# EAGLE design AmpSwitchAutomatic_main (EAGLE 6.0)
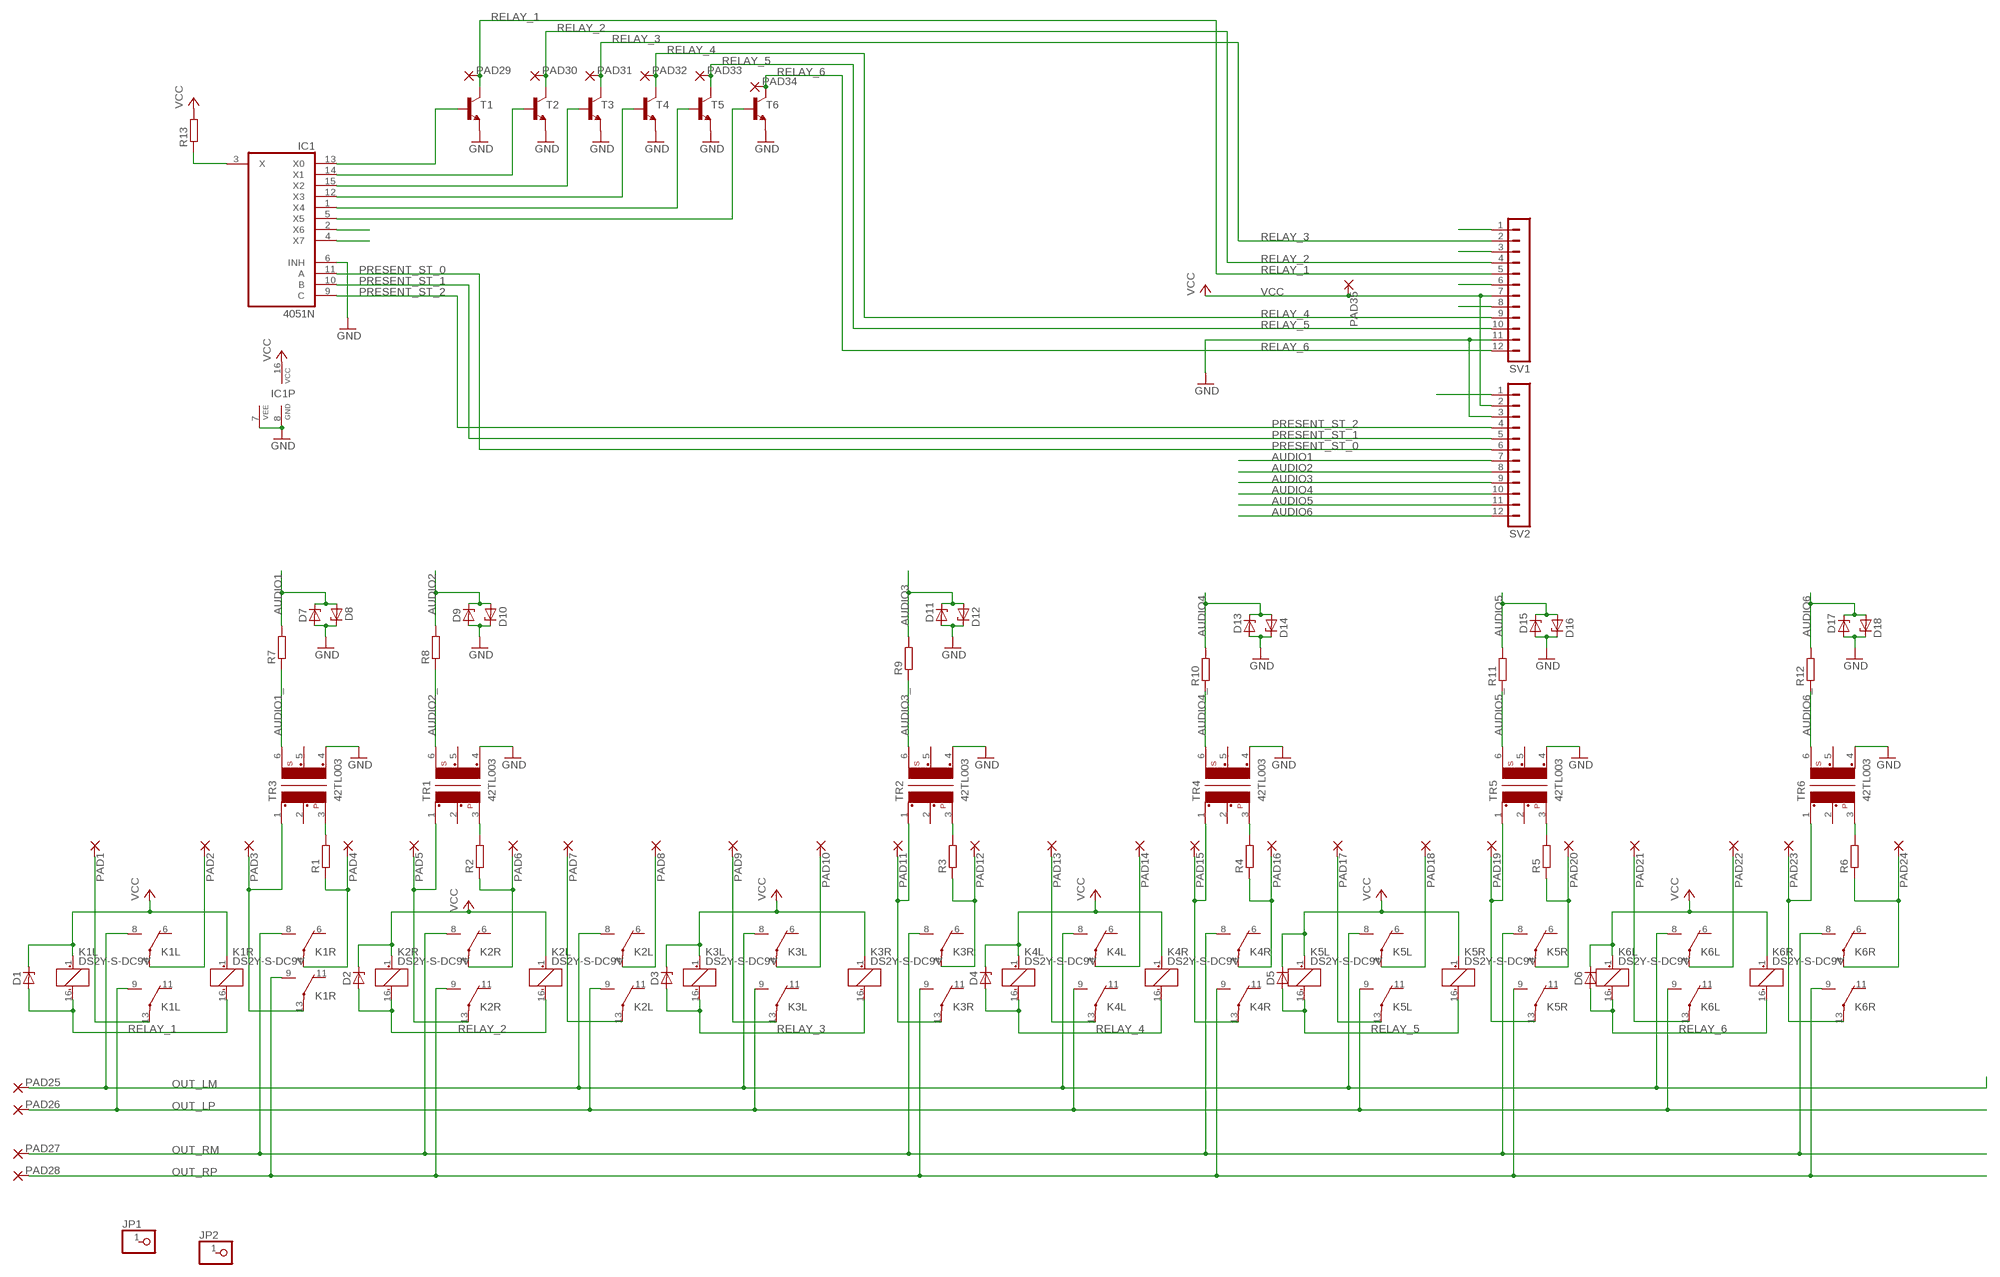
[diagram p0: schematic, sheet 1]

## Parts
D1  ZENER-DIODEZD-5  [ZDIO-5]
D2  ZENER-DIODEZD-7.5  [ZDIO-7.5]
D3  ZENER-DIODEZD-12.5  [ZDIO12.5]
D4  ZENER-DIODEZD-5  [ZDIO-5]
D5  ZENER-DIODEZD-5  [ZDIO-5]
D6  ZENER-DIODEZD-12.5  [ZDIO12.5]
D7  ZENER-DIODEZD-7.5  [ZDIO-7.5]
D8  ZENER-DIODEZD-7.5  [ZDIO-7.5]
D9  ZENER-DIODEZD-7.5  [ZDIO-7.5]
D10  ZENER-DIODEZD-7.5  [ZDIO-7.5]
D11  ZENER-DIODEZD-7.5  [ZDIO-7.5]
D12  ZENER-DIODEZD-7.5  [ZDIO-7.5]
D13  ZENER-DIODEZD-7.5  [ZDIO-7.5]
D14  ZENER-DIODEZD-7.5  [ZDIO-7.5]
D15  ZENER-DIODEZD-7.5  [ZDIO-7.5]
D16  ZENER-DIODEZD-7.5  [ZDIO-7.5]
D17  ZENER-DIODEZD-7.5  [ZDIO-7.5]
D18  ZENER-DIODEZD-7.5  [ZDIO-7.5]
IC1  4051N  [DIL16]
JP1  PINHD-1X1  [1X01]
JP2  PINHD-1X1  [1X01]
K1L  DS2Y-S-DC9V  [DS2Y]
K1R  DS2Y-S-DC9V  [DS2Y]
K2L  DS2Y-S-DC9V  [DS2Y]
K2R  DS2Y-S-DC9V  [DS2Y]
K3L  DS2Y-S-DC9V  [DS2Y]
K3R  DS2Y-S-DC9V  [DS2Y]
K4L  DS2Y-S-DC9V  [DS2Y]
K4R  DS2Y-S-DC9V  [DS2Y]
K5L  DS2Y-S-DC9V  [DS2Y]
K5R  DS2Y-S-DC9V  [DS2Y]
K6L  DS2Y-S-DC9V  [DS2Y]
K6R  DS2Y-S-DC9V  [DS2Y]
PAD1  WIREPAD2,15/1,0  [2,15/1,0]
PAD2  WIREPAD2,15/1,0  [2,15/1,0]
PAD3  WIREPAD2,15/1,0  [2,15/1,0]
PAD4  WIREPAD2,15/1,0  [2,15/1,0]
PAD5  WIREPAD2,15/1,0  [2,15/1,0]
PAD6  WIREPAD2,15/1,0  [2,15/1,0]
PAD7  WIREPAD2,15/1,0  [2,15/1,0]
PAD8  WIREPAD2,15/1,0  [2,15/1,0]
PAD9  WIREPAD2,15/1,0  [2,15/1,0]
PAD10  WIREPAD2,15/1,0  [2,15/1,0]
PAD11  WIREPAD2,15/1,0  [2,15/1,0]
PAD12  WIREPAD2,15/1,0  [2,15/1,0]
PAD13  WIREPAD2,15/1,0  [2,15/1,0]
PAD14  WIREPAD2,15/1,0  [2,15/1,0]
PAD15  WIREPAD2,15/1,0  [2,15/1,0]
PAD16  WIREPAD2,15/1,0  [2,15/1,0]
PAD17  WIREPAD2,15/1,0  [2,15/1,0]
PAD18  WIREPAD2,15/1,0  [2,15/1,0]
PAD19  WIREPAD2,15/1,0  [2,15/1,0]
PAD20  WIREPAD2,15/1,0  [2,15/1,0]
PAD21  WIREPAD2,15/1,0  [2,15/1,0]
PAD22  WIREPAD2,15/1,0  [2,15/1,0]
PAD23  WIREPAD2,15/1,0  [2,15/1,0]
PAD24  WIREPAD2,15/1,0  [2,15/1,0]
PAD25  WIREPAD2,15/1,0  [2,15/1,0]
PAD26  WIREPAD2,15/1,0  [2,15/1,0]
PAD27  WIREPAD2,15/1,0  [2,15/1,0]
PAD28  WIREPAD2,15/1,0  [2,15/1,0]
PAD29  WIREPAD2,15/1,0  [2,15/1,0]
PAD30  WIREPAD2,15/1,0  [2,15/1,0]
PAD31  WIREPAD2,15/1,0  [2,15/1,0]
PAD32  WIREPAD2,15/1,0  [2,15/1,0]
PAD33  WIREPAD2,15/1,0  [2,15/1,0]
PAD34  WIREPAD2,15/1,0  [2,15/1,0]
PAD35  WIREPAD2,15/1,0  [2,15/1,0]
R1  R-EU_0207/15  [0207/15]
R2  R-EU_0207/15  [0207/15]
R3  R-EU_0207/15  [0207/15]
R4  R-EU_0207/15  [0207/15]
R5  R-EU_0207/15  [0207/15]
R6  R-EU_0207/15  [0207/15]
R7  R-EU_0207/12  [0207/12]
R8  R-EU_0207/10  [0207/10]
R9  R-EU_0207/7  [0207/7]
R10  R-EU_0207/5V  [0207/5V]
R11  R-EU_0207/2V  [0207/2V]
R12  R-EU_0207/5V  [0207/5V]
R13  R-EU_0207/7  [0207/7]
SV1  MA12-1  [MA12-1]
SV2  MA12-1  [MA12-1]
T1  2N4124-NPN-TO92-CBE  [TO92-CBE]
T2  2N4124-NPN-TO92-CBE  [TO92-CBE]
T3  2N4124-NPN-TO92-CBE  [TO92-CBE]
T4  2N4124-NPN-TO92-CBE  [TO92-CBE]
T5  2N4124-NPN-TO92-CBE  [TO92-CBE]
T6  2N4124-NPN-TO92-CBE  [TO92-CBE]
TR1  42TL003  [42TL]
TR2  42TL003  [42TL]
TR3  42TL003  [42TL]
TR4  42TL003  [42TL]
TR5  42TL003  [42TL]
TR6  42TL003  [42TL]

## Nets
AUDIO1: D7.C D8.A R7.2 SV2.7
AUDIO1_: R7.1 TR3.6
AUDIO2: D9.C D10.A R8.2 SV2.8
AUDIO2_: R8.1 TR1.6
AUDIO3: D11.C D12.A R9.2 SV2.9
AUDIO3_: R9.1 TR2.6
AUDIO4: D13.C D14.A R10.2 SV2.10
AUDIO4_: R10.1 TR4.6
AUDIO5: D15.C D16.A R11.2 SV2.11
AUDIO5_: R11.1 TR5.6
AUDIO6: D17.C D18.A R12.2 SV2.12
AUDIO6_: R12.1 TR6.6
GND: D7.A D8.C D9.A D10.C D11.A D12.C D13.A D14.C D15.A D16.C D17.A D18.C IC1.6(INH) IC1.7(VEE) IC1.8(GND) SV1.11 SV2.3 T1.E T2.E T3.E T4.E T5.E T6.E TR1.4 TR2.4 TR3.4 TR4.4 TR5.4 TR6.4
N$1: K3R.4(2:P) PAD12.1(P) R3.1
N$3: K4L.13(3:P) PAD13.1(P)
N$4: K1L.13(3:P) PAD1.1(P)
N$11: K2L.13(3:P) PAD7.1(P)
N$12: K1L.4(2:P) PAD2.1(P)
N$13: K3L.13(3:P) PAD9.1(P)
N$14: K1R.13(3:P) PAD3.1(P) TR3.1
N$19: K1R.4(2:P) PAD4.1(P) R1.1
N$20: K3L.4(2:P) PAD10.1(P)
N$21: K4L.4(2:P) PAD14.1(P)
N$22: K2R.13(3:P) PAD5.1(P) TR1.1
N$23: R1.2 TR3.3
N$24: R2.2 TR1.3
N$25: R3.2 TR2.3
N$26: K3R.13(3:P) PAD11.1(P) TR2.1
N$27: K2R.4(2:P) PAD6.1(P) R2.1
N$28: R4.2 TR4.3
N$29: K4R.13(3:P) PAD15.1(P) TR4.1
N$30: K4R.4(2:P) PAD16.1(P) R4.1
N$31: R5.2 TR5.3
N$32: K2L.4(2:P) PAD8.1(P)
N$33: R6.2 TR6.3
N$34: IC1.3(X) R13.1
N$35: IC1.13(X0) T1.B
N$36: IC1.14(X1) T2.B
N$37: IC1.2(X6)
N$38: K5L.13(3:P) PAD17.1(P)
N$39: K5L.4(2:P) PAD18.1(P)
N$40: K5R.13(3:P) PAD19.1(P) TR5.1
N$41: K5R.4(2:P) PAD20.1(P) R5.1
N$42: K6L.13(3:P) PAD21.1(P)
N$43: K6L.4(2:P) PAD22.1(P)
N$44: K6R.13(3:P) PAD23.1(P) TR6.1
N$45: K6R.4(2:P) PAD24.1(P) R6.1
N$46: IC1.15(X2) T3.B
N$47: IC1.12(X3) T4.B
N$48: IC1.1(X4) T5.B
N$49: IC1.5(X5) T6.B
N$50: IC1.4(X7)
N$53: SV2.1
N$54: SV1.6
N$55: SV1.8
N$56: SV1.1
N$57: SV1.3
OUT_LM: K1L.8(2:S) K2L.8(2:S) K3L.8(2:S) K4L.8(2:S) K5L.8(2:S) K6L.8(2:S) PAD25.1(P)
OUT_LP: K1L.9(3:S) K2L.9(3:S) K3L.9(3:S) K4L.9(3:S) K5L.9(3:S) K6L.9(3:S) PAD26.1(P)
OUT_RM: K1R.8(2:S) K2R.8(2:S) K3R.8(2:S) K4R.8(2:S) K5R.8(2:S) K6R.8(2:S) PAD27.1(P)
OUT_RP: K1R.9(3:S) K2R.9(3:S) K3R.9(3:S) K4R.9(3:S) K5R.9(3:S) K6R.9(3:S) PAD28.1(P)
PRESENT_ST_0: IC1.11(A) SV2.6
PRESENT_ST_1: IC1.10(B) SV2.5
PRESENT_ST_2: IC1.9(C) SV2.4
RELAY_1: D1.A K1L.16(1:-) K1R.16(1:-) PAD29.1(P) SV1.5 T1.C
RELAY_2: D2.A K2L.16(1:-) K2R.16(1:-) PAD30.1(P) SV1.4 T2.C
RELAY_3: D3.A K3L.16(1:-) K3R.16(1:-) PAD31.1(P) SV1.2 T3.C
RELAY_4: D4.A K4L.16(1:-) K4R.16(1:-) PAD32.1(P) SV1.9 T4.C
RELAY_5: D5.A K5L.16(1:-) K5R.16(1:-) PAD33.1(P) SV1.10 T5.C
RELAY_6: D6.A K6L.16(1:-) K6R.16(1:-) PAD34.1(P) SV1.12 T6.C
VCC: D1.C D2.C D3.C D4.C D5.C D6.C IC1.16(VCC) K1L.1(1:+) K1R.1(1:+) K2L.1(1:+) K2R.1(1:+) K3L.1(1:+) K3R.1(1:+) K4L.1(1:+) K4R.1(1:+) K5L.1(1:+) K5R.1(1:+) K6L.1(1:+) K6R.1(1:+) PAD35.1(P) R13.2 SV1.7 SV2.2
Unconnected: JP1.1 JP2.1 K1L.6(2:O) K1L.11(3:O) K1R.6(2:O) K1R.11(3:O) K2L.6(2:O) K2L.11(3:O) K2R.6(2:O) K2R.11(3:O) K3L.6(2:O) K3L.11(3:O) K3R.6(2:O) K3R.11(3:O) K4L.6(2:O) K4L.11(3:O) K4R.6(2:O) K4R.11(3:O) K5L.6(2:O) K5L.11(3:O) K5R.6(2:O) K5R.11(3:O) K6L.6(2:O) K6L.11(3:O) K6R.6(2:O) K6R.11(3:O) TR1.2 TR1.5 TR2.2 TR2.5 TR3.2 TR3.5 TR4.2 TR4.5 TR5.2 TR5.5 TR6.2 TR6.5

## Library data of the parts
D1-D18 = diode:ZENER-DIODE: Z-Diode
IC1 = 40xx:4051: 8-channel ANALOG MULTIPLEXER
JP1 JP2 = pinhead:PINHD-1X1: PIN HEADER
K1L K1R K2L K2R K3L K3R K4L K4R K5L K5R K6L K6R = relay:DS2Y-S-DC*: MINIATURE RELAY NAiS Source: http://www.mew-europe.com/.. en_ds_61005_0023.pdf; MPN: DS2Y-S-DC9V; OC_FARNELL: unknown; OC_NEWARK: 13P3272
PAD1-PAD35 = wirepad:WIREPAD: Wire PAD connect wire on PCB
R1-R6 = resistor:R-EU_: RESISTOR, European symbol
R7-R13 = rcl:R-EU_: RESISTOR, European symbol
SV1 SV2 = con-lstb:MA12-1: PIN HEADER; OC_FARNELL: unknown; OC_NEWARK: unknown
T1-T6 = transistor:*-NPN-: NPN Transistror BF959 corrected 2008.03.06
TR1-TR6 = trafo-xicon:42T?*: Xicon Micro-Mini EI-12 Audio Transformers 42TL/42TC/42TM Series Source: http://www.mouser.com//catalog/specsheets/164201.pdf http://www.mouser.com/catalog/specsheets/114225.pdf http://www.mouser.com/catalog/specsheets/164267.pdf; OC_FARNELL: unknown; OC_NEWARK: unknown

## Board
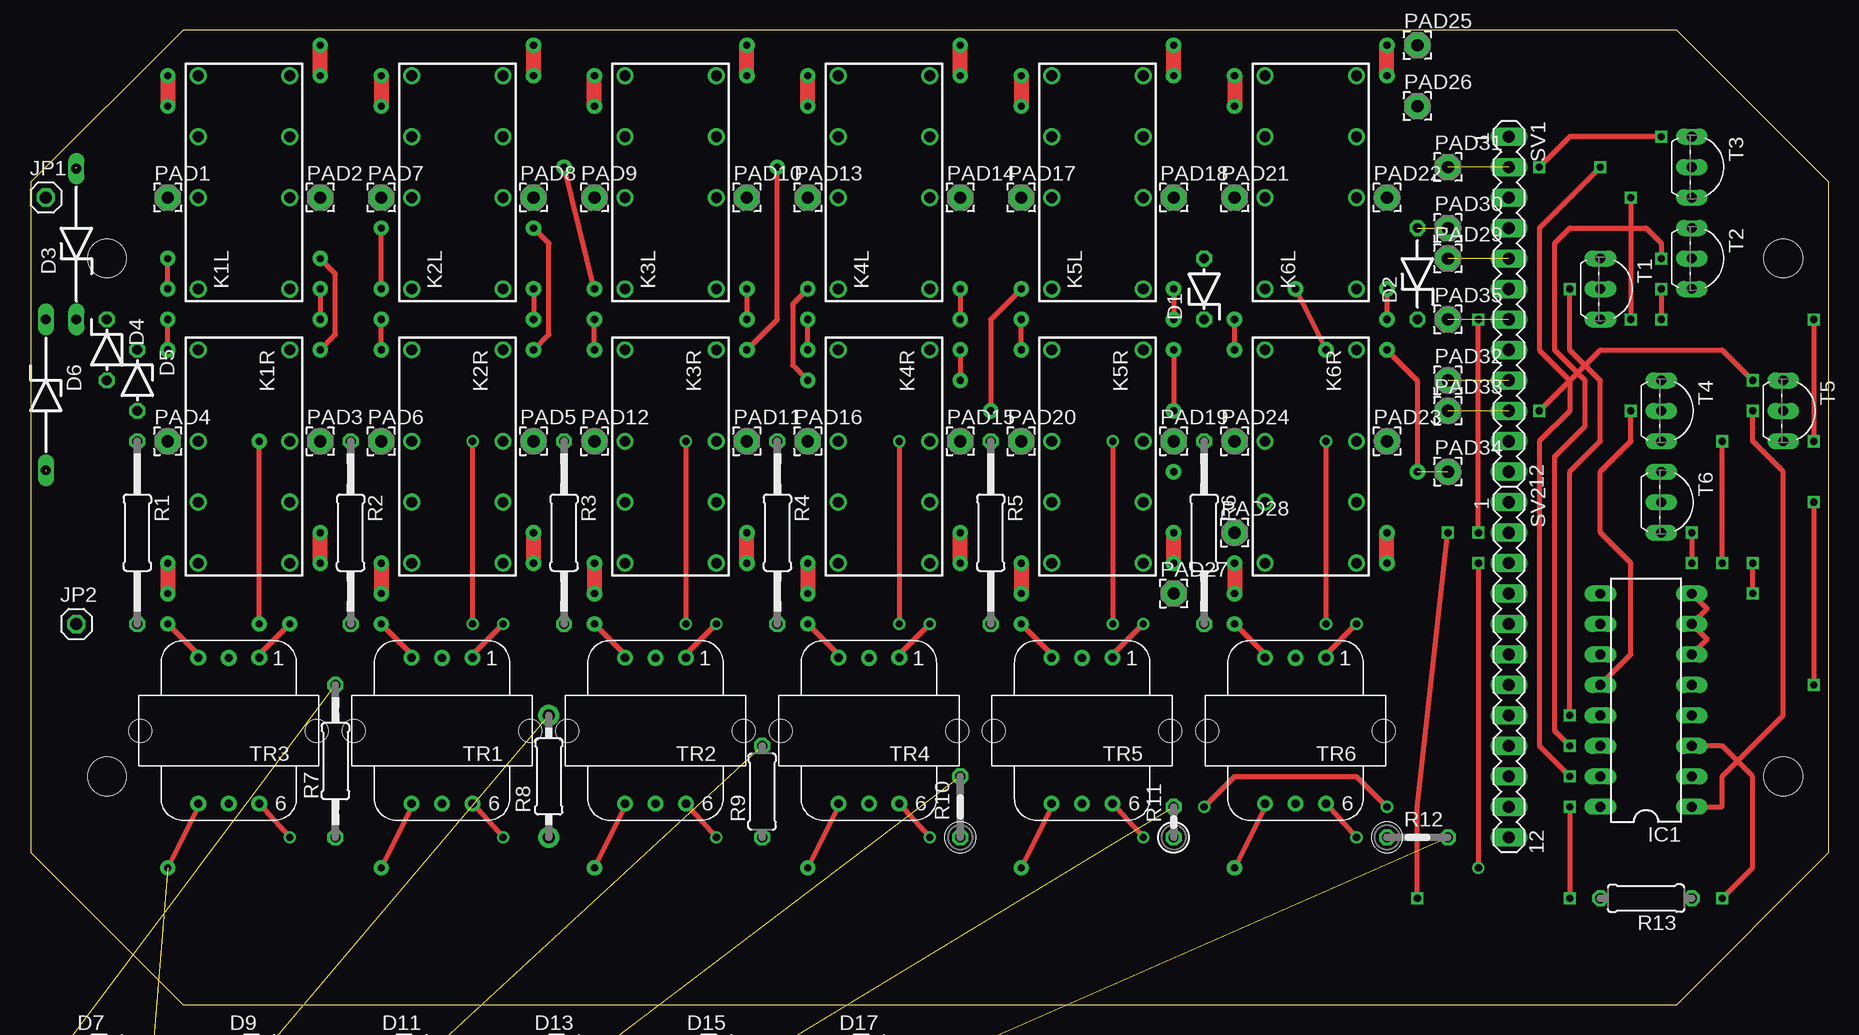
[diagram p1: board, top side]
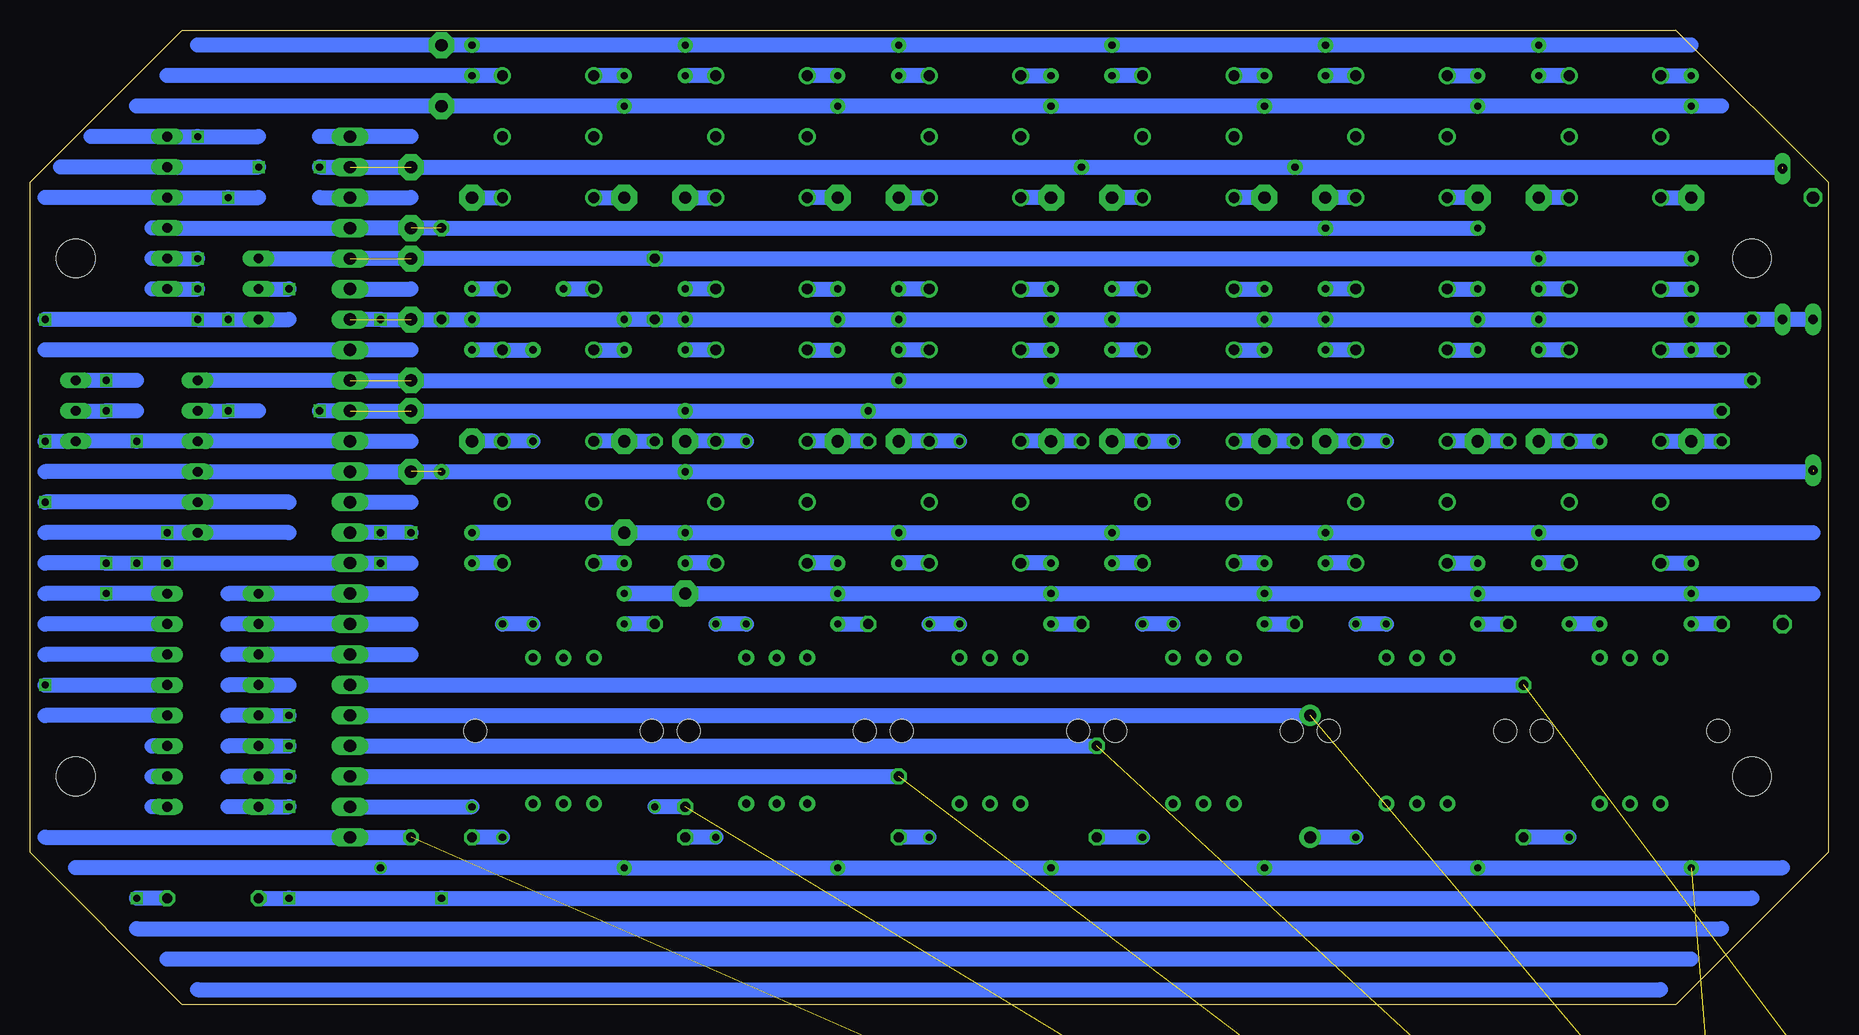
[diagram p2: board, bottom side, seen from below]

Size 149.86 x 81.28 mm. Coordinates in mm from the lower left corner, seen from the top.
Outline: 12.7,0 137.16,0 149.86,12.7 149.86,68.58 137.16,81.28 12.7,81.28 0,68.58 0,12.7 12.7,0
Copper layers (1*16): Top 0.035mm / dielectric 1.5mm / Bottom 0.035mm
Design rules: minimum track width 10mil, minimum drill 24mil, track to track 8mil, track to pad 8mil, pad to pad 8mil, via to via 8mil, smd to smd 8mil, copper to edge 40mil, drill to drill 8mil, minimum pad ring 10mil, minimum via ring 8mil, stop-mask expansion 4mil, vias tented up to drill 0mil, thermal gap 10mil
Holes 3.2 mm at 6.35,19.05 6.35,62.23 146.05,19.05 146.05,62.23
tKeepout: area 139.7,58.4 to 149.9,66; area 139.7,15.2 to 149.9,22.9; area 0,58.4 to 10.2,66; area 0,15.2 to 10.2,22.9

### Footprints (pad centres in the part's own frame; a part is rotated, then mirrored left to right if it is on the bottom)
ZDIO-5 = drill 0.813 octagon: A 2.54,0; C -2.54,0
ZDIO-7.5 = drill 0.813 octagon: A 3.81,0; C -3.81,0
ZDIO12.5 = drill 0.813 long: A 6.223,0; C -6.35,0
DIL16 = drill 0.813 long: 1 -8.89,-3.81; 2 -6.35,-3.81; 3 -3.81,-3.81; 4 -1.27,-3.81; 5 1.27,-3.81; 6 3.81,-3.81; 7 6.35,-3.81; 8 8.89,-3.81; 9 8.89,3.81; 10 6.35,3.81; 11 3.81,3.81; 12 1.27,3.81; 13 -1.27,3.81; 14 -3.81,3.81; 15 -6.35,3.81; 16 -8.89,3.81
1X01 = drill 1.016 octagon: 1 0,0
DS2Y = drill 0.9: 1 -8.89,-3.81; 4 -1.27,-3.81; 6 3.81,-3.81; 8 8.89,-3.81; 9 8.89,3.81; 11 3.81,3.81; 13 -1.27,3.81; 16 -8.89,3.81
2,15/1,0 = drill 1.016 pad 2.159 octagon: 1 0,0
0207/15 = drill 0.813 octagon: 1 -7.62,0; 2 7.62,0
0207/12 = drill 0.813 octagon: 1 -6.35,0; 2 6.35,0
0207/10 = drill 1.016 pad 1.778: 1 -5.08,0; 2 5.08,0
0207/7 = drill 0.813 octagon: 1 -3.81,0; 2 3.81,0
0207/5V = drill 0.813 octagon: 1 -2.54,0; 2 2.54,0
0207/2V = drill 0.813 octagon: 1 -1.27,0; 2 1.27,0
MA12-1 = drill 1.016 long: 1 -13.97,0; 2 -11.43,0; 3 -8.89,0; 4 -6.35,0; 5 -3.81,0; 6 -1.27,0; 7 1.27,0; 8 3.81,0; 9 6.35,0; 10 8.89,0; 11 11.43,0; 12 13.97,0
TO92-CBE = drill 0.813 long: B 0,0; C -2.54,0; E 2.54,0
42TL = drill 0.7 pad 1.3: 1 -2.54,-6.096; 2 0,-6.068; 3 2.54,-6.096; 4 2.54,6.096; 5 0,6.096; 6 -2.54,6.096 | hole 1.9: -7.353,0; 7.353,0

### Placement (x,y rotation side)
D1  97.79,59.69 90 top
D2  115.57,60.96 90 top
D3  3.81,63.5 90 top
D4  6.35,54.61 270 top
D5  8.89,52.07 270 top
D6  1.27,50.8 270 top
D7  6.35,-3.81 0 top  (outside the outline)
D8  6.35,-8.89 180 top  (outside the outline)
D9  19.05,-3.81 0 top  (outside the outline)
D10  19.05,-8.89 180 top  (outside the outline)
D11  31.75,-3.81 0 top  (outside the outline)
D12  31.75,-8.89 180 top  (outside the outline)
D13  44.45,-3.81 0 top  (outside the outline)
D14  44.45,-8.89 180 top  (outside the outline)
D15  57.15,-3.81 0 top  (outside the outline)
D16  57.15,-8.89 180 top  (outside the outline)
D17  69.85,-3.81 0 top  (outside the outline)
D18  69.85,-8.89 180 top  (outside the outline)
IC1  134.62,25.4 90 top
JP1  1.27,67.31 0 top
JP2  3.81,31.75 0 top
K1L  17.78,68.58 90 top
K1R  17.78,45.72 270 top
K2L  35.56,68.58 90 top
K2R  35.56,45.72 270 top
K3L  53.34,68.58 90 top
K3R  53.34,45.72 270 top
K4L  71.12,68.58 90 top
K4R  71.12,45.72 270 top
K5L  88.9,68.58 90 top
K5R  88.9,45.72 270 top
K6L  106.68,68.58 90 top
K6R  106.68,45.72 270 top
PAD1  11.43,67.31 0 top
PAD2  24.13,67.31 0 top
PAD3  24.13,46.99 0 top
PAD4  11.43,46.99 0 top
PAD5  41.91,46.99 0 top
PAD6  29.21,46.99 0 top
PAD7  29.21,67.31 0 top
PAD8  41.91,67.31 0 top
PAD9  46.99,67.31 0 top
PAD10  59.69,67.31 0 top
PAD11  59.69,46.99 0 top
PAD12  46.99,46.99 0 top
PAD13  64.77,67.31 0 top
PAD14  77.47,67.31 0 top
PAD15  77.47,46.99 0 top
PAD16  64.77,46.99 0 top
PAD17  82.55,67.31 0 top
PAD18  95.25,67.31 0 top
PAD19  95.25,46.99 0 top
PAD20  82.55,46.99 0 top
PAD21  100.33,67.31 0 top
PAD22  113.03,67.31 0 top
PAD23  113.03,46.99 0 top
PAD24  100.33,46.99 0 top
PAD25  115.57,80.01 0 top
PAD26  115.57,74.93 0 top
PAD27  95.25,34.29 0 top
PAD28  100.33,39.37 0 top
PAD29  118.11,62.23 0 top
PAD30  118.11,64.77 0 top
PAD31  118.11,69.85 0 top
PAD32  118.11,52.07 0 top
PAD33  118.11,49.53 0 top
PAD34  118.11,44.45 0 top
PAD35  118.11,57.15 0 top
R1  8.89,39.37 270 top
R2  26.67,39.37 270 top
R3  44.45,39.37 270 top
R4  62.23,39.37 270 top
R5  80.01,39.37 270 top
R6  97.79,39.37 270 top
R7  25.4,20.32 90 top
R8  43.18,19.05 90 top
R9  60.96,17.78 90 top
R10  77.47,16.51 90 top
R11  95.25,15.24 90 top
R12  115.57,13.97 0 top
R13  134.62,8.89 180 top
SV1  123.19,58.42 270 top
SV2  123.19,27.94 270 top
T1  130.81,59.69 270 top
T2  138.43,62.23 270 top
T3  138.43,69.85 270 top
T4  135.89,49.53 270 top
T5  146.05,49.53 270 top
T6  135.89,41.91 270 top
TR1  34.29,22.86 180 top
TR2  52.07,22.86 180 top
TR3  16.51,22.86 180 top
TR4  69.85,22.86 180 top
TR5  87.63,22.86 180 top
TR6  105.41,22.86 180 top

### Tracks (layer width: path | path; a pad name or v marks a point on that pad's centre or on a via)
AUDIO1  (2 unrouted)
  Bottom 1.27: SV2.7 R7.2
AUDIO1_  (via drill 0.6)
  Top 0.406: TR3.6 v21.59,13.97
  Bottom 1.27: v21.59,13.97 R7.1
AUDIO2  (2 unrouted)
  Bottom 1.27: SV2.8 R8.2
AUDIO2_  (via drill 0.6)
  Top 0.406: TR1.6 v39.37,13.97
  Bottom 1.27: v39.37,13.97 R8.1
AUDIO3  (2 unrouted)
  Bottom 1.27: SV2.9 R9.2
AUDIO3_  (via drill 0.6)
  Top 0.406: TR2.6 v57.15,13.97
  Bottom 1.27: v57.15,13.97 R9.1
AUDIO4  (2 unrouted)
  Bottom 1.27: SV2.10 R10.2
AUDIO4_  (via drill 0.6)
  Top 0.406: TR4.6 v74.93,13.97
  Bottom 1.27: v74.93,13.97 R10.1
AUDIO5  (via drill 0.6)  (2 unrouted)
  Top 0.406: v97.79,16.51 100.33,19.05 110.49,19.05 v113.03,16.51
  Bottom 1.27: R11.2 v97.79,16.51 | SV2.11 v113.03,16.51
AUDIO5_  (via drill 0.6)
  Top 0.406: TR5.6 v92.71,13.97
  Bottom 1.27: v92.71,13.97 R11.1
AUDIO6  (2 unrouted)
  Bottom 1.27: R12.2 SV2.12 148.59,13.97
AUDIO6_  (via drill 0.6)
  Top 0.406: TR6.6 v110.49,13.97
  Bottom 1.27: v110.49,13.97 R12.1
GND  (via drill 0.6, 0.6 pad 1.27)  (12 unrouted)
  Top 0.406: v11.43,11.43 13.97,16.51 TR3.4 | v29.21,11.43 31.75,16.51 TR1.4 | v46.99,11.43 49.53,16.51 TR2.4 | v64.77,11.43 67.31,16.51 TR4.4 | v82.55,11.43 85.09,16.51 TR5.4 | v100.33,11.43 102.87,16.51 TR6.4 | v120.65,36.83 v120.65,11.43 | v135.89,59.69 v135.89,57.15 | v133.35,67.31 v133.35,57.15 | v148.59,57.15 v148.59,46.99 | v138.43,39.37 v138.43,36.83 | v143.51,34.29 v143.51,36.83 | v140.97,36.83 v140.97,46.99 | IC1.8 139.7,33.02 IC1.7 139.7,30.48 IC1.6
  Bottom 1.27: 3.81,11.43 v11.43,11.43 v29.21,11.43 v46.99,11.43 v64.77,11.43 v82.55,11.43 v100.33,11.43 v120.65,11.43 146.05,11.43 | v138.43,39.37 T6.E | v135.89,59.69 T2.E 139.7,59.69 | v148.59,57.15 v135.89,57.15 v133.35,57.15 T1.E 128.27,57.15 | v148.59,46.99 T5.E v140.97,46.99 T4.E SV1.11 118.11,46.99 | 148.59,36.83 v143.51,36.83 v140.97,36.83 v138.43,36.83 SV2.3 v120.65,36.83 118.11,36.83 | IC1.8 v143.51,34.29 148.59,34.29 | IC1.7 148.59,31.75 | IC1.6 148.59,29.21 | 148.59,67.31 T3.E v133.35,67.31 130.81,67.31
N$1
  Bottom 1.27: K3R.4 PAD12.1 R3.1
N$3
  Bottom 1.27: PAD13.1 K4L.13
N$4
  Bottom 1.27: K1L.13 PAD1.1
N$11
  Bottom 1.27: PAD7.1 K2L.13
N$12
  Bottom 1.27: K1L.4 PAD2.1
N$13
  Bottom 1.27: PAD9.1 K3L.13
N$14  (via drill 0.6 pad 1.27)
  Top 0.406: v21.59,31.75 19.05,29.21 TR3.1 | v19.05,31.75 v19.05,46.99
  Bottom 1.27: PAD3.1 K1R.13 v19.05,46.99 | v19.05,31.75 v21.59,31.75
N$19
  Bottom 1.27: K1R.4 PAD4.1 R1.1
N$20
  Bottom 1.27: K3L.4 PAD10.1
N$21
  Bottom 1.27: PAD14.1 K4L.4
N$22  (via drill 0.6 pad 0.41)
  Top 0.406: v36.83,31.75 v36.83,46.99 | v39.37,31.75 36.83,29.21 TR1.1
  Bottom 1.27: PAD5.1 K2R.13 v36.83,46.99 | v36.83,31.75 v39.37,31.75
N$23  (via drill 0.6 pad 1.27)
  Top 0.406: v11.43,31.75 13.97,29.21 TR3.3
  Bottom 1.27: R1.2 v11.43,31.75
N$24  (via drill 0.6 pad 1.27)
  Top 0.406: TR1.3 31.75,29.21 v29.21,31.75
  Bottom 1.27: v29.21,31.75 R2.2
N$25  (via drill 0.6 pad 1.27)
  Top 0.406: TR2.3 49.53,29.21 v46.99,31.75
  Bottom 1.27: v46.99,31.75 R3.2
N$26  (via drill 0.6 pad 0.41)
  Top 0.406: v54.61,46.99 v54.61,31.75 | v57.15,31.75 54.61,29.21 TR2.1
  Bottom 1.27: PAD11.1 K3R.13 v54.61,46.99 | v54.61,31.75 v57.15,31.75
N$27
  Bottom 1.27: K2R.4 PAD6.1 R2.1
N$28  (via drill 0.6 pad 1.27)
  Top 0.406: TR4.3 67.31,29.21 v64.77,31.75
  Bottom 1.27: v64.77,31.75 R4.2
N$29  (via drill 0.6 pad 0.41)
  Top 0.406: v72.39,46.99 v72.39,31.75 | v74.93,31.75 72.39,29.21 TR4.1
  Bottom 1.27: PAD15.1 K4R.13 v72.39,46.99 | v72.39,31.75 v74.93,31.75
N$30
  Bottom 1.27: K4R.4 PAD16.1 R4.1
N$31  (via drill 0.6 pad 1.27)
  Top 0.406: TR5.3 85.09,29.21 v82.55,31.75
  Bottom 1.27: v82.55,31.75 R5.2
N$32
  Bottom 1.27: K2L.4 PAD8.1
N$33  (via drill 0.6 pad 1.27)
  Top 0.406: v100.33,31.75 102.87,29.21 TR6.3
  Bottom 1.27: R6.2 v100.33,31.75
N$34  (via drill 0.6)
  Top 0.406: v140.97,8.89 143.51,11.43 143.51,19.05 140.97,21.59 IC1.3
  Bottom 1.27: R13.1 v140.97,8.89 | IC1.3 139.7,21.59
N$35  (via drill 0.6)
  Top 0.406: v128.27,24.13 128.27,44.45 130.81,46.99 130.81,52.07 128.27,54.61 v128.27,59.69
  Bottom 1.27: T1.B v128.27,59.69 | v128.27,24.13 IC1.13 133.35,24.13
N$36  (via drill 0.6)
  Top 0.406: v128.27,21.59 127,22.86 127,45.72 129.54,48.26 129.54,52.07 127,54.61 127,63.5 128.27,64.77 134.62,64.77 135.89,63.5 v135.89,62.23
  Bottom 1.27: v135.89,62.23 T2.B 139.7,62.23 | v128.27,21.59 IC1.14 133.35,21.59
N$37
  Bottom 1.27: IC1.2 139.7,19.05
N$38
  Bottom 1.27: PAD17.1 K5L.13
N$39
  Bottom 1.27: PAD18.1 K5L.4
N$40  (via drill 0.6 pad 0.41)
  Top 0.406: v90.17,46.99 v90.17,31.75 | v92.71,31.75 90.17,29.21 TR5.1
  Bottom 1.27: PAD19.1 K5R.13 v90.17,46.99 | v90.17,31.75 v92.71,31.75
N$41
  Bottom 1.27: K5R.4 PAD20.1 R5.1
N$42
  Bottom 1.27: K6L.13 PAD21.1
N$43
  Bottom 1.27: PAD22.1 K6L.4
N$44  (via drill 0.6 pad 0.41)
  Top 0.406: v107.95,31.75 v107.95,46.99 | v110.49,31.75 107.95,29.21 TR6.1
  Bottom 1.27: PAD23.1 K6R.13 v107.95,46.99 | v107.95,31.75 v110.49,31.75
N$45
  Bottom 1.27: K6R.4 PAD24.1 R6.1
N$46  (via drill 0.6)
  Top 0.406: v130.81,69.85 125.73,64.77 125.73,54.61 128.27,52.07 128.27,49.53 125.73,46.99 125.73,21.59 v128.27,19.05
  Bottom 1.27: v130.81,69.85 T3.B 147.32,69.85 | v128.27,19.05 IC1.15 133.35,19.05
N$47  (via drill 0.6)
  Top 0.406: IC1.12 133.35,29.21 133.35,36.83 130.81,39.37 130.81,44.45 133.35,46.99 v133.35,49.53
  Bottom 1.27: T4.B v133.35,49.53 130.81,49.53 | 128.27,26.67 IC1.12 133.35,26.67
N$48  (via drill 0.6)
  Top 0.406: IC1.1 140.97,16.51 140.97,19.05 146.05,24.13 146.05,44.45 143.51,46.99 v143.51,49.53
  Bottom 1.27: T5.B v143.51,49.53 140.97,49.53 | IC1.1 139.7,16.51
N$49  (via drill 0.6)
  Top 0.406: v148.59,41.91 v148.59,26.67
  Bottom 1.27: v148.59,41.91 T6.B 128.27,41.91 | v148.59,26.67 IC1.5
N$50
  Bottom 1.27: IC1.4 148.59,24.13
N$51
  Bottom 1.27: 128.27,39.37 148.59,39.37
N$52
  Bottom 1.27: 118.11,54.61 148.59,54.61
N$53
  Bottom 1.27: SV2.1 118.11,41.91
N$54
  Bottom 1.27: SV1.6 118.11,59.69
N$58
  Bottom 1.27: 118.11,72.39 125.73,72.39
N$59
  Bottom 1.27: 125.73,67.31 118.11,67.31
N$60
  Bottom 1.27: 140.97,6.35 8.89,6.35
N$61
  Bottom 1.27: 11.43,3.81 138.43,3.81
N$62
  Bottom 1.27: 135.89,1.27 13.97,1.27
OUT_LM  (via drill 0.6 pad 1.27)
  Top 1.27: v41.91,77.47 v41.91,80.01 | v24.13,77.47 v24.13,80.01 | v59.69,77.47 v59.69,80.01 | v77.47,77.47 v77.47,80.01 | v95.25,77.47 v95.25,80.01 | v113.03,77.47 v113.03,80.01
  Bottom 1.27: K2L.8 v41.91,77.47 | K1L.8 v24.13,77.47 | 11.43,80.01 v24.13,80.01 v41.91,80.01 v59.69,80.01 v77.47,80.01 v95.25,80.01 v113.03,80.01 PAD25.1 135.89,80.01 | K3L.8 v59.69,77.47 | K4L.8 v77.47,77.47 | K5L.8 v95.25,77.47 | K6L.8 v113.03,77.47 138.43,77.47
OUT_LP  (via drill 0.6 pad 1.27)
  Top 1.27: v11.43,77.47 v11.43,74.93 | v29.21,77.47 v29.21,74.93 | v46.99,74.93 v46.99,77.47 | v100.33,77.47 v100.33,74.93 | v82.55,77.47 v82.55,74.93 | v64.77,74.93 v64.77,77.47
  Bottom 1.27: K2L.9 v29.21,77.47 | K1L.9 v11.43,77.47 | 8.89,74.93 v11.43,74.93 v29.21,74.93 v46.99,74.93 v64.77,74.93 v82.55,74.93 v100.33,74.93 PAD26.1 140.97,74.93 | K4L.9 v64.77,77.47 | v82.55,77.47 K5L.9 | v100.33,77.47 K6L.9 | v46.99,77.47 K3L.9
OUT_RM  (via drill 0.6 pad 1.27)
  Top 1.27: v11.43,36.83 v11.43,34.29 | v29.21,36.83 v29.21,34.29 | v46.99,36.83 v46.99,34.29 | v64.77,36.83 v64.77,34.29 | v82.55,36.83 v82.55,34.29 | v100.33,36.83 v100.33,34.29
  Bottom 1.27: PAD27.1 v100.33,34.29 v82.55,34.29 v64.77,34.29 v46.99,34.29 v29.21,34.29 v11.43,34.29 1.27,34.29 | K1R.8 v11.43,36.83 | K2R.8 v29.21,36.83 | v46.99,36.83 K3R.8 | v64.77,36.83 K4R.8 | v82.55,36.83 K5R.8 | v100.33,36.83 K6R.8
OUT_RP  (via drill 0.6 pad 1.27)
  Top 1.27: v113.03,36.83 v113.03,39.37 | v95.25,36.83 v95.25,39.37 | v77.47,36.83 v77.47,39.37 | v59.69,36.83 v59.69,39.37 | v41.91,36.83 v41.91,39.37 | v24.13,36.83 v24.13,39.37
  Bottom 1.27: K1R.9 v24.13,36.83 | K2R.9 v41.91,36.83 | K3R.9 v59.69,36.83 | K4R.9 v77.47,36.83 | K5R.9 v95.25,36.83 | K6R.9 v113.03,36.83 | PAD28.1 v113.03,39.37 v95.25,39.37 v77.47,39.37 v59.69,39.37 v41.91,39.37 v24.13,39.37 1.27,39.37
PRESENT_ST_0
  Bottom 1.27: 133.35,29.21 IC1.11 SV2.6 118.11,29.21
PRESENT_ST_1
  Bottom 1.27: 133.35,31.75 IC1.10 SV2.5 118.11,31.75
PRESENT_ST_2
  Bottom 1.27: 133.35,34.29 IC1.9 SV2.4 118.11,34.29
RELAY_1  (via drill 0.6 pad 1.27)  (1 unrouted)
  Top 0.406: v24.13,54.61 25.4,55.88 25.4,60.96 v24.13,62.23 | v11.43,59.69 v11.43,62.23
  Bottom 1.27: v11.43,62.23 v24.13,62.23 D1.A SV1.5 T1.C | K1L.16 v11.43,59.69 | K1R.16 v24.13,54.61
RELAY_2  (via drill 0.6 pad 1.27)  (1 unrouted)
  Top 0.406: v29.21,59.69 v29.21,64.77 | v41.91,54.61 43.18,55.88 43.18,63.5 v41.91,64.77
  Bottom 1.27: v29.21,64.77 v41.91,64.77 D2.A SV1.4 T2.C 139.7,64.77 | K2L.16 v29.21,59.69 | K2R.16 v41.91,54.61
RELAY_3  (via drill 0.6, 0.6 pad 1.27)  (2 unrouted)
  Top 0.406: v46.99,59.69 v44.45,69.85 | v59.69,54.61 62.23,57.15 v62.23,69.85 | v135.89,72.39 128.27,72.39 v125.73,69.85
  Bottom 1.27: 3.81,69.85 v44.45,69.85 v62.23,69.85 SV1.2 v125.73,69.85 | K3L.16 v46.99,59.69 | K3R.16 v59.69,54.61 | 144.78,72.39 T3.C v135.89,72.39 130.81,72.39
RELAY_4  (via drill 0.6 pad 1.27)  (1 unrouted)
  Top 0.406: v64.77,59.69 63.5,58.42 63.5,53.34 v64.77,52.07 | v77.47,54.61 v77.47,52.07
  Bottom 1.27: K4L.16 v64.77,59.69 | K4R.16 v77.47,54.61 | D4.A v64.77,52.07 v77.47,52.07 SV1.9 T4.C
RELAY_5  (via drill 0.6, 0.6 pad 1.27)  (1 unrouted)
  Top 0.406: v82.55,59.69 80.01,57.15 v80.01,49.53 | v95.25,54.61 v95.25,49.53 | v125.73,49.53 130.81,54.61 140.97,54.61 v143.51,52.07
  Bottom 1.27: K5R.16 v95.25,54.61 | K5L.16 v82.55,59.69 | D5.A v80.01,49.53 v95.25,49.53 SV1.10 v125.73,49.53 | T5.C v143.51,52.07 140.97,52.07
RELAY_6  (via drill 0.6 pad 1.27)  (2 unrouted)
  Top 0.406: v113.03,54.61 115.57,52.07 v115.57,44.45 | v107.95,54.61 v105.41,59.69
  Bottom 1.27: v113.03,54.61 K6R.16 v107.95,54.61 | 1.27,44.45 v95.25,44.45 v115.57,44.45 SV1.12 T6.C 148.59,44.45 | K6L.16 v105.41,59.69
VCC  (via drill 0.6, 0.6 pad 1.27)  (1 unrouted)
  Top 0.406: v113.03,59.69 v113.03,57.15 | v95.25,59.69 v95.25,57.15 | v77.47,59.69 v77.47,57.15 | v64.77,54.61 v64.77,57.15 | v59.69,59.69 v59.69,57.15 | v46.99,54.61 v46.99,57.15 | v41.91,59.69 v41.91,57.15 | v29.21,54.61 v29.21,57.15 | v24.13,59.69 v24.13,57.15 | v11.43,54.61 v11.43,57.15 | v82.55,54.61 v82.55,57.15 | v100.33,54.61 v100.33,57.15 | v115.57,8.89 115.57,16.51 v118.11,39.37 | v120.65,39.37 v120.65,57.15 | v128.27,16.51 v128.27,8.89
  Bottom 1.27: K1R.1 v11.43,54.61 D5.C | K1L.1 v24.13,59.69 | K2R.1 v29.21,54.61 | K2L.1 v41.91,59.69 | K3R.1 v46.99,54.61 | K3L.1 v59.69,59.69 | K4R.1 v64.77,54.61 | K4L.1 v77.47,59.69 | K5R.1 v82.55,54.61 | K5L.1 v95.25,59.69 | K6R.1 v100.33,54.61 | K6L.1 v113.03,59.69 | D6.C D3.C D4.C v11.43,57.15 v24.13,57.15 v29.21,57.15 v41.91,57.15 v46.99,57.15 v59.69,57.15 v64.77,57.15 v77.47,57.15 v82.55,57.15 v95.25,57.15 D1.C v100.33,57.15 v113.03,57.15 D2.C v120.65,57.15 SV1.7 | R13.2 v128.27,8.89 v115.57,8.89 6.35,8.89 | v128.27,16.51 IC1.16 133.35,16.51 | v118.11,39.37 v120.65,39.37 SV2.2

### Text on the board
tOrigins: Left- | Left+ | Right+ | Right-